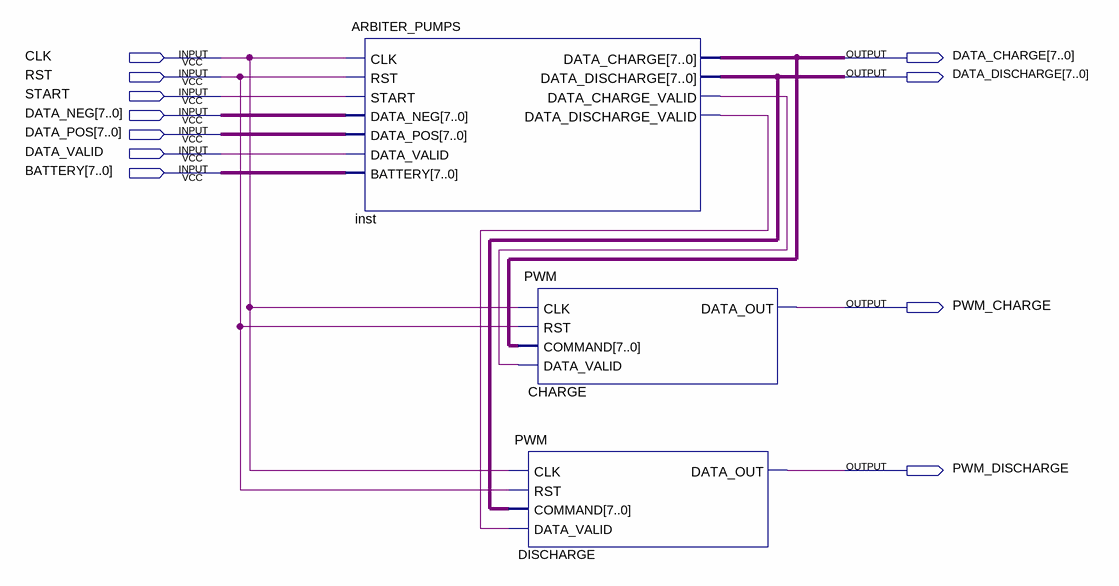
[diagram p0: schematic sheet]
// Quartus schematic pumps.bdf as structural Verilog: 3 symbols, 11 pins
module pumps (
  input  CLK,
  input  RST,
  input  START,
  input  [7:0] DATA_NEG,
  input  [7:0] DATA_POS,
  input  DATA_VALID,
  input  [7:0] BATTERY,
  output [7:0] DATA_CHARGE,
  output [7:0] DATA_DISCHARGE,
  output PWM_CHARGE,
  output PWM_DISCHARGE
);

  wire inst_data_charge_valid, inst_data_discharge_valid;

  ARBITER_PUMPS inst (
    .CLK(CLK), .RST(RST), .START(START), .DATA_NEG(DATA_NEG), .DATA_POS(DATA_POS), .DATA_VALID(DATA_VALID),
    .BATTERY(BATTERY), .DATA_CHARGE(DATA_CHARGE), .DATA_DISCHARGE(DATA_DISCHARGE),
    .DATA_CHARGE_VALID(inst_data_charge_valid), .DATA_DISCHARGE_VALID(inst_data_discharge_valid));
  PWM CHARGE (.CLK(CLK), .RST(RST), .COMMAND(DATA_CHARGE), .DATA_VALID(inst_data_charge_valid), .DATA_OUT(PWM_CHARGE));
  PWM DISCHARGE (
    .CLK(CLK), .RST(RST), .COMMAND(DATA_DISCHARGE), .DATA_VALID(inst_data_discharge_valid),
    .DATA_OUT(PWM_DISCHARGE));
endmodule
